# Altium schematic sheet stm32_module.SchDoc
size A
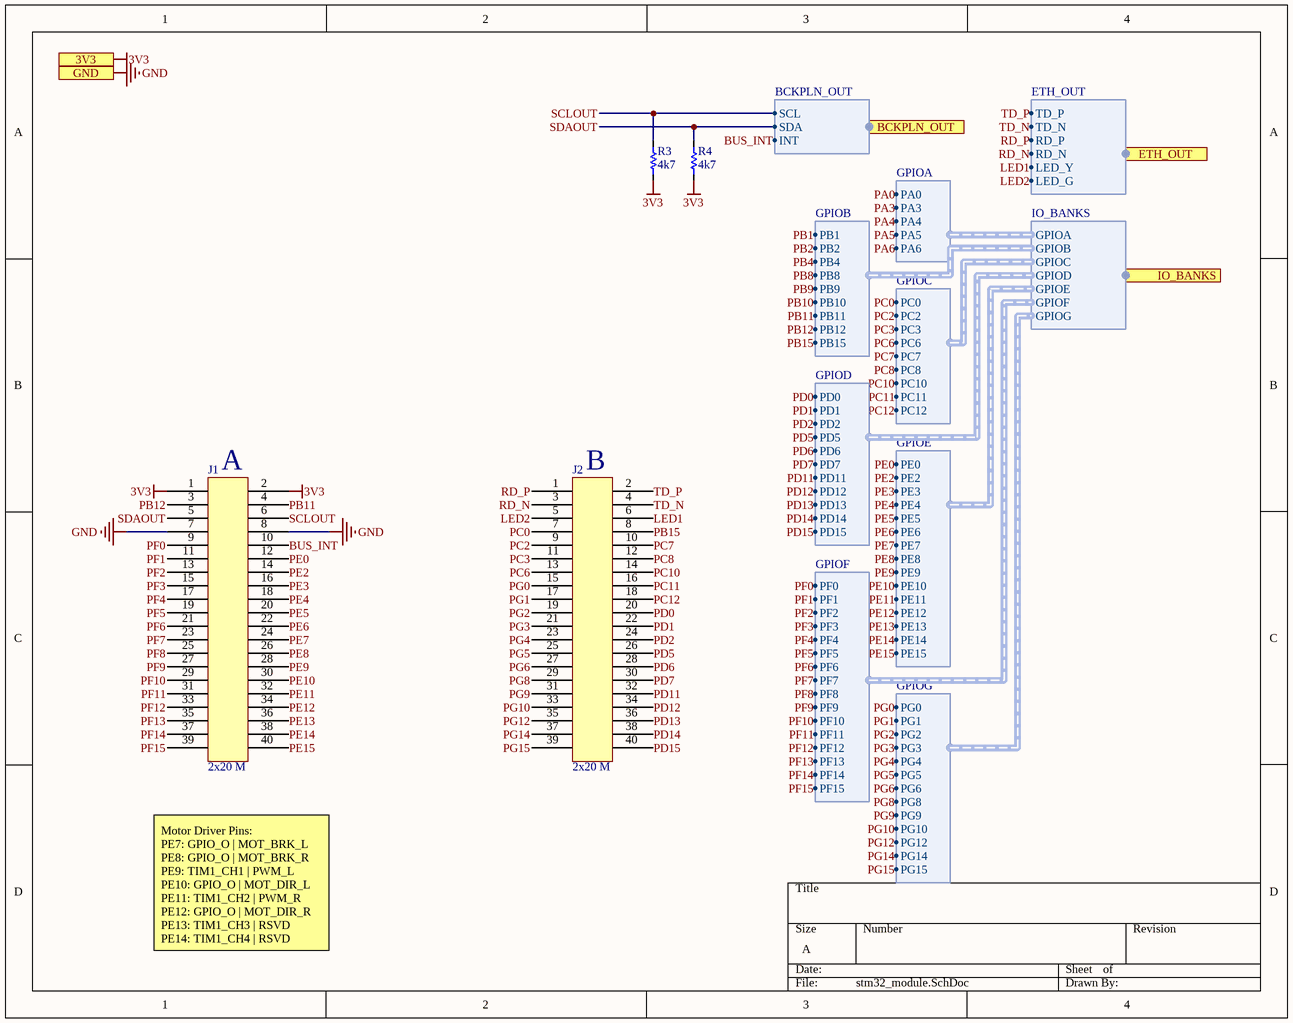
[diagram p0: stm32_module.SchDoc]

## Parts
J1  2x20 M  [CONN HDR 2x20 M TOP]
J2  2x20 M  [CONN HDR 2x20 M TOP]
R3  4k7  [RES 0603 L]
R4  4k7  [RES 0603 L]

## Ports
3V3, BCKPLN_OUT (harness BCKPLN_OUT), ETH_OUT (harness ETH_OUT), GND, IO_BANKS (harness IO_BANKS)

## Harnesses
ETH_OUT: TD_P, TD_N, RD_P, RD_N, LED_Y, LED_G
IO_BANKS: GPIOA, GPIOB, GPIOC, GPIOD, GPIOE, GPIOF, GPIOG
GPIOA: PA0, PA3, PA4, PA5, PA6
GPIOB: PB1, PB2, PB4, PB8, PB9, PB10, PB11, PB12, PB15
GPIOC: PC0, PC2, PC3, PC6, PC7, PC8, PC10, PC11, PC12
GPIOD: PD0, PD1, PD2, PD5, PD6, PD7, PD11, PD12, PD13, PD14, PD15
GPIOE: PE0, PE2, PE3, PE4, PE5, PE6, PE7, PE8, PE9, PE10, PE11, PE12, PE13, PE14, PE15
GPIOF: PF0, PF1, PF2, PF3, PF4, PF5, PF6, PF7, PF8, PF9, PF10, PF11, PF12, PF13, PF14, PF15
GPIOG: PG0, PG1, PG2, PG3, PG4, PG5, PG6, PG8, PG9, PG10, PG12, PG14, PG15
BCKPLN_OUT: SCL, SDA, INT

## Nets
3V3: J1.1 J1.2 R3.1 R4.1 ; port 3V3
GND: J1.7 J1.8 ; port GND
BUS_INT: J1.10 ; port BCKPLN_OUT.INT
LED1: J2.6 ; port ETH_OUT.LED_Y
LED2: J2.5 ; port ETH_OUT.LED_G
PA0: harness GPIOA.PA0
PA3: harness GPIOA.PA3
PA4: harness GPIOA.PA4
PA5: harness GPIOA.PA5
PB1: harness GPIOB.PB1
PB2: harness GPIOB.PB2
PB4: harness GPIOB.PB4
PB8: harness GPIOB.PB8
PB9: harness GPIOB.PB9
PB10: harness GPIOB.PB10
PB11: J1.4 ; harness GPIOB.PB11
PB12: J1.3 ; harness GPIOB.PB12
PB15: J2.8 ; harness GPIOB.PB15
PC0: J2.7 ; harness GPIOC.PC0
PC2: J2.9 ; harness GPIOC.PC2
PC3: J2.11 ; harness GPIOC.PC3
PC6: J2.13 ; harness GPIOC.PC6
PC7: J2.10 ; harness GPIOC.PC7
PC8: J2.12 ; harness GPIOC.PC8
PC10: J2.14 ; harness GPIOC.PC10
PC11: J2.16 ; harness GPIOC.PC11
PC12: J2.18 ; harness GPIOC.PC12
PD0: J2.20 ; harness GPIOD.PD0
PD1: J2.22 ; harness GPIOD.PD1
PD2: J2.24 ; harness GPIOD.PD2
PD5: J2.26 ; harness GPIOD.PD5
PD6: J2.28 ; harness GPIOD.PD6
PD7: J2.30 ; harness GPIOD.PD7
PD11: J2.32 ; harness GPIOD.PD11
PD12: J2.34 ; harness GPIOD.PD12
PD13: J2.36 ; harness GPIOD.PD13
PD14: J2.38 ; harness GPIOD.PD14
PD15: J2.40 ; harness GPIOD.PD15
PE0: J1.12 ; harness GPIOE.PE0
PE2: J1.14 ; harness GPIOE.PE2
PE3: J1.16 ; harness GPIOE.PE3
PE4: J1.18 ; harness GPIOE.PE4
PE5: J1.20 ; harness GPIOE.PE5
PE6: J1.22 ; harness GPIOE.PE6
PE7: J1.24 ; harness GPIOE.PE7
PE8: J1.26 ; harness GPIOE.PE8
PE9: J1.28 ; harness GPIOE.PE9
PE10: J1.30 ; harness GPIOE.PE10
PE11: J1.32 ; harness GPIOE.PE11
PE12: J1.34 ; harness GPIOE.PE12
PE13: J1.36 ; harness GPIOE.PE13
PE14: J1.38 ; harness GPIOE.PE14
PE15: J1.40 ; harness GPIOE.PE15
PF0: J1.9 ; harness GPIOF.PF0
PF1: J1.11 ; harness GPIOF.PF1
PF2: J1.13 ; harness GPIOF.PF2
PF3: J1.15 ; harness GPIOF.PF3
PF4: J1.17 ; harness GPIOF.PF4
PF5: J1.19 ; harness GPIOF.PF5
PF6: J1.21 ; harness GPIOF.PF6
PF7: J1.23 ; harness GPIOF.PF7
PF8: J1.25 ; harness GPIOF.PF8
PF9: J1.27 ; harness GPIOF.PF9
PF10: J1.29 ; harness GPIOF.PF10
PF11: J1.31 ; harness GPIOF.PF11
PF12: J1.33 ; harness GPIOF.PF12
PF13: J1.35 ; harness GPIOF.PF13
PF14: J1.37 ; harness GPIOF.PF14
PF15: J1.39 ; harness GPIOF.PF15
PG0: J2.15 ; harness GPIOG.PG0
PG1: J2.17 ; harness GPIOG.PG1
PG2: J2.19 ; harness GPIOG.PG2
PG3: J2.21 ; harness GPIOG.PG3
PG4: J2.23 ; harness GPIOG.PG4
PG5: J2.25 ; harness GPIOG.PG5
PG6: J2.27 ; harness GPIOG.PG6
PG8: J2.29 ; harness GPIOG.PG8
PG9: J2.31 ; harness GPIOG.PG9
PG10: J2.33 ; harness GPIOG.PG10
PG12: J2.35 ; harness GPIOG.PG12
PG14: J2.37 ; harness GPIOG.PG14
PG15: J2.39 ; harness GPIOG.PG15
RD_N: J2.3 ; port ETH_OUT.RD_N
RD_P: J2.1 ; port ETH_OUT.RD_P
SCLOUT: J1.6 R3.2 ; port BCKPLN_OUT.SCL
SDAOUT: J1.5 R4.2 ; port BCKPLN_OUT.SDA
TD_N: J2.4 ; port ETH_OUT.TD_N
TD_P: J2.2 ; port ETH_OUT.TD_P

## Notes on the sheet
- (near J1) A
- (near J2) B
- Motor Driver Pins:
  PE7: GPIO_O | MOT_BRK_L
  PE8: GPIO_O | MOT_BRK_R
  PE9: TIM1_CH1 | PWM_L
  PE10: GPIO_O | MOT_DIR_L
  PE11: TIM1_CH2 | PWM_R
  PE12: GPIO_O | MOT_DIR_R
  PE13: TIM1_CH3 | RSVD
  PE14: TIM1_CH4 | RSVD
- Labels drawn without touching a wire or pin: PA6

## Library data of the parts
J1 J2 = CONN Header 2x20 M: Supplier 1: Digi-Key; Supplier Part Number 1: ED10529-ND
R3 R4 = RES 0603